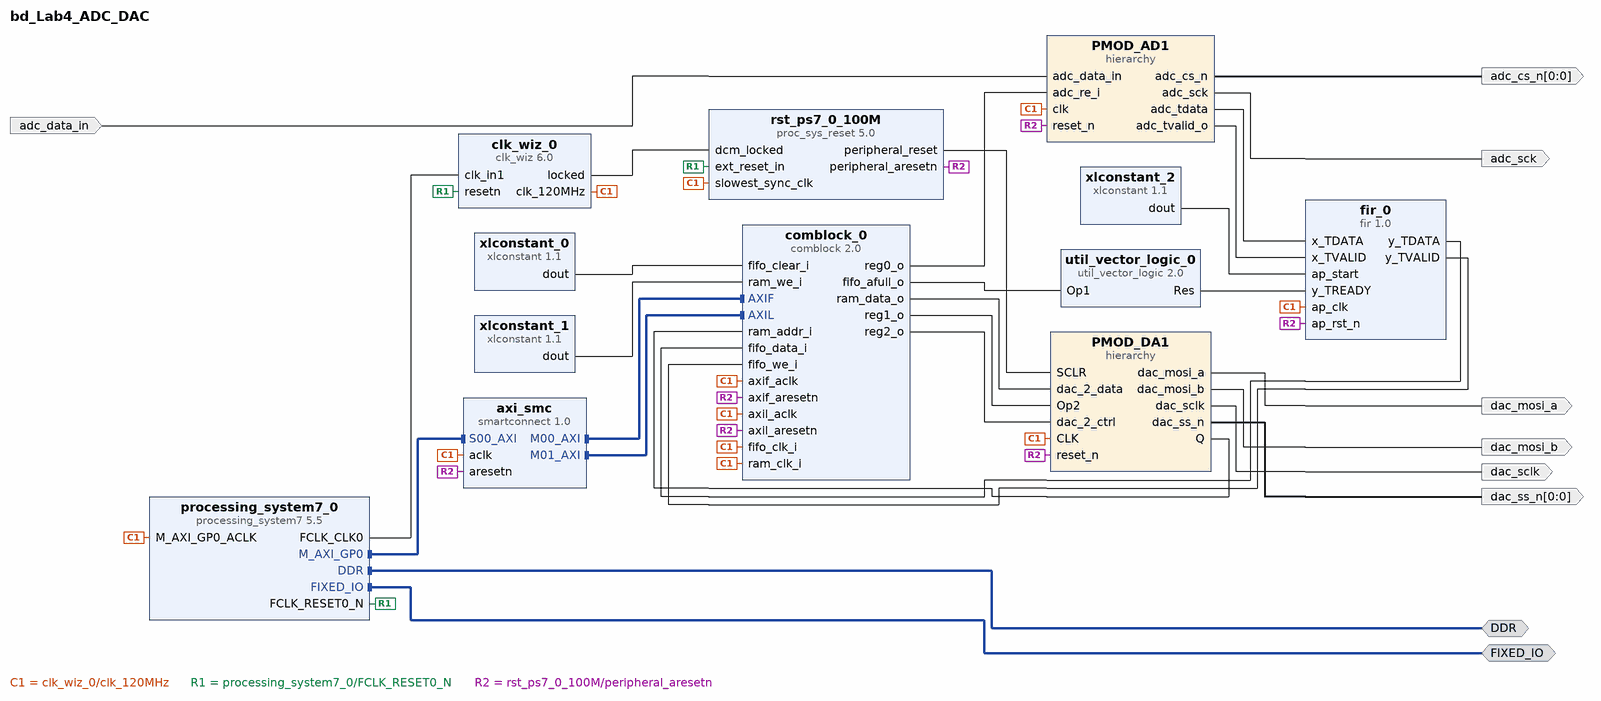
[diagram p0: block diagram of the top level]
# Vivado block design bd_Lab4_ADC_DAC, xc7z020clg484-1, Vivado 2022.2
create_bd_design bd_Lab4_ADC_DAC

create_bd_intf_port -mode Master -vlnv xilinx.com:interface:ddrx_rtl:1.0 DDR
create_bd_intf_port -mode Master -vlnv xilinx.com:display_processing_system7:fixedio_rtl:1.0 FIXED_IO
create_bd_port -dir O -from 0 -to 0 adc_cs_n
create_bd_port -dir I adc_data_in
create_bd_port -dir O adc_sck
create_bd_port -dir O dac_mosi_a
create_bd_port -dir O dac_mosi_b
create_bd_port -dir O dac_sclk
create_bd_port -dir O -from 0 -to 0 dac_ss_n

create_bd_cell -type hier PMOD_AD1
create_bd_cell -type hier PMOD_DA1
create_bd_cell -type ip -vlnv xilinx.com:ip:smartconnect:1.0 axi_smc
set_property -dict {CONFIG.NUM_MI 2 CONFIG.NUM_SI 1} [get_bd_cells axi_smc]
create_bd_cell -type ip -vlnv xilinx.com:ip:clk_wiz:6.0 clk_wiz_0
set_property -dict [list \
  CONFIG.CLKOUT1_DRIVES BUFG \
  CONFIG.CLKOUT1_JITTER 234.636 \
  CONFIG.CLKOUT1_PHASE_ERROR 298.923 \
  CONFIG.CLKOUT1_REQUESTED_OUT_FREQ 120.000 \
  CONFIG.CLKOUT2_DRIVES BUFG \
  CONFIG.CLKOUT3_DRIVES BUFG \
  CONFIG.CLKOUT4_DRIVES BUFG \
  CONFIG.CLKOUT5_DRIVES BUFG \
  CONFIG.CLKOUT6_DRIVES BUFG \
  CONFIG.CLKOUT7_DRIVES BUFG \
  CONFIG.CLK_OUT1_PORT clk_120MHz \
  CONFIG.FEEDBACK_SOURCE FDBK_AUTO \
  CONFIG.MMCM_BANDWIDTH OPTIMIZED \
  CONFIG.MMCM_CLKFBOUT_MULT_F 50.250 \
  CONFIG.MMCM_CLKOUT0_DIVIDE_F 8.375 \
  CONFIG.MMCM_COMPENSATION ZHOLD \
  CONFIG.MMCM_DIVCLK_DIVIDE 5 \
  CONFIG.PRIMITIVE MMCM \
  CONFIG.RESET_PORT resetn \
  CONFIG.RESET_TYPE ACTIVE_LOW \
  CONFIG.USE_LOCKED true \
  CONFIG.USE_RESET true \
] [get_bd_cells clk_wiz_0]
create_bd_cell -type ip -vlnv www.ictp.it:user:comblock:2.0 comblock_0
set_property -dict [list \
  CONFIG.DRAM_IO_AWIDTH 12 \
  CONFIG.DRAM_IO_DEPTH 4096 \
  CONFIG.DRAM_IO_DWIDTH 8 \
  CONFIG.FIFO_IN_DEPTH 4096 \
  CONFIG.REGS_IN_ENA false \
  CONFIG.REGS_OUT_DEPTH 3 \
] [get_bd_cells comblock_0]
create_bd_cell -type ip -vlnv xilinx.com:ip:processing_system7:5.5 processing_system7_0
set_property -dict [list \
  CONFIG.PCW_APU_PERIPHERAL_FREQMHZ 666.666667 \
  CONFIG.PCW_ENET0_ENET0_IO {MIO 16 .. 27} \
  CONFIG.PCW_ENET0_GRP_MDIO_ENABLE 1 \
  CONFIG.PCW_ENET0_GRP_MDIO_IO {MIO 52 .. 53} \
  CONFIG.PCW_ENET0_PERIPHERAL_ENABLE 1 \
  CONFIG.PCW_ENET0_RESET_ENABLE 0 \
  CONFIG.PCW_ENET_RESET_ENABLE 1 \
  CONFIG.PCW_ENET_RESET_SELECT {Share reset pin} \
  CONFIG.PCW_FPGA0_PERIPHERAL_FREQMHZ 100.000000 \
  CONFIG.PCW_FPGA1_PERIPHERAL_FREQMHZ 150.000000 \
  CONFIG.PCW_FPGA2_PERIPHERAL_FREQMHZ 50.000000 \
  CONFIG.PCW_GPIO_MIO_GPIO_ENABLE 1 \
  CONFIG.PCW_GPIO_MIO_GPIO_IO MIO \
  CONFIG.PCW_I2C_RESET_ENABLE 1 \
  CONFIG.PCW_PRESET_BANK1_VOLTAGE {LVCMOS 1.8V} \
  CONFIG.PCW_QSPI_GRP_SINGLE_SS_ENABLE 1 \
  CONFIG.PCW_QSPI_GRP_SINGLE_SS_IO {MIO 1 .. 6} \
  CONFIG.PCW_QSPI_PERIPHERAL_ENABLE 1 \
  CONFIG.PCW_QSPI_PERIPHERAL_FREQMHZ 200.000000 \
  CONFIG.PCW_QSPI_QSPI_IO {MIO 1 .. 6} \
  CONFIG.PCW_SD0_GRP_CD_ENABLE 1 \
  CONFIG.PCW_SD0_GRP_CD_IO {MIO 47} \
  CONFIG.PCW_SD0_GRP_WP_ENABLE 1 \
  CONFIG.PCW_SD0_GRP_WP_IO {MIO 46} \
  CONFIG.PCW_SD0_PERIPHERAL_ENABLE 1 \
  CONFIG.PCW_SD0_SD0_IO {MIO 40 .. 45} \
  CONFIG.PCW_SDIO_PERIPHERAL_FREQMHZ 50 \
  CONFIG.PCW_SINGLE_QSPI_DATA_MODE x4 \
  CONFIG.PCW_UART1_PERIPHERAL_ENABLE 1 \
  CONFIG.PCW_UART1_UART1_IO {MIO 48 .. 49} \
  CONFIG.PCW_UART_PERIPHERAL_FREQMHZ 50 \
  CONFIG.PCW_UIPARAM_DDR_FREQ_MHZ 533.333313 \
  CONFIG.PCW_UIPARAM_DDR_PARTNO {MT41J128M16 HA-15E} \
  CONFIG.PCW_USB0_PERIPHERAL_ENABLE 0 \
  CONFIG.PCW_USB_RESET_ENABLE 1 \
  CONFIG.preset ZedBoard \
] [get_bd_cells processing_system7_0]
# 221 more settings of processing_system7_0 are not shown: defaults, MIO pin electricals, DDR timing, and values the tool derives
create_bd_cell -type ip -vlnv xilinx.com:ip:proc_sys_reset:5.0 rst_ps7_0_100M
create_bd_cell -type ip -vlnv xilinx.com:ip:util_vector_logic:2.0 util_vector_logic_0
set_property -dict {CONFIG.C_OPERATION not CONFIG.C_SIZE 1} [get_bd_cells util_vector_logic_0]
create_bd_cell -type ip -vlnv xilinx.com:ip:xlconstant:1.1 xlconstant_0
set_property -dict {CONFIG.CONST_VAL 0} [get_bd_cells xlconstant_0]
create_bd_cell -type ip -vlnv xilinx.com:ip:xlconstant:1.1 xlconstant_1
set_property -dict {CONFIG.CONST_VAL 0} [get_bd_cells xlconstant_1]
create_bd_cell -type ip -vlnv xilinx.com:ip:xlconstant:1.1 xlconstant_2
create_bd_cell -type ip -vlnv xilinx.com:hls:fir:1.0 fir_0

# ---- hierarchy /PMOD_AD1 ----
current_bd_instance /PMOD_AD1
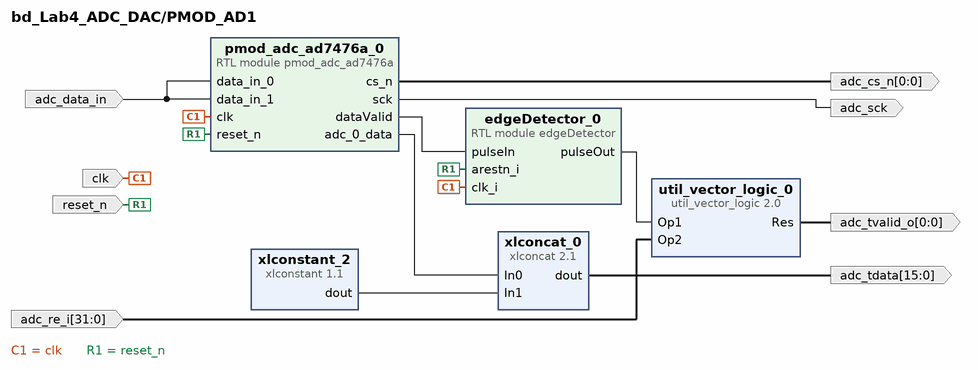
[diagram p1: block diagram inside /PMOD_AD1]
create_bd_pin -dir O -from 0 -to 0 adc_cs_n
create_bd_pin -dir I adc_data_in
create_bd_pin -dir I -from 31 -to 0 adc_re_i
create_bd_pin -dir O adc_sck
create_bd_pin -dir O -from 15 -to 0 adc_tdata
create_bd_pin -dir O -from 0 -to 0 adc_tvalid_o
create_bd_pin -dir I -type clk clk
create_bd_pin -dir I -type rst reset_n

create_bd_cell -type module -reference edgeDetector edgeDetector_0
create_bd_cell -type module -reference pmod_adc_ad7476a pmod_adc_ad7476a_0
set_property -dict {CONFIG.clk_freq 120 CONFIG.spi_clk_div 2} [get_bd_cells pmod_adc_ad7476a_0]
create_bd_cell -type ip -vlnv xilinx.com:ip:util_vector_logic:2.0 util_vector_logic_0
set_property -dict {CONFIG.C_SIZE 1} [get_bd_cells util_vector_logic_0]
create_bd_cell -type ip -vlnv xilinx.com:ip:xlconcat:2.1 xlconcat_0
set_property -dict {CONFIG.IN0_WIDTH 12 CONFIG.IN1_WIDTH 4} [get_bd_cells xlconcat_0]
create_bd_cell -type ip -vlnv xilinx.com:ip:xlconstant:1.1 xlconstant_2
set_property -dict {CONFIG.CONST_VAL 0 CONFIG.CONST_WIDTH 4} [get_bd_cells xlconstant_2]

# ---- hierarchy /PMOD_DA1 ----
current_bd_instance /PMOD_DA1
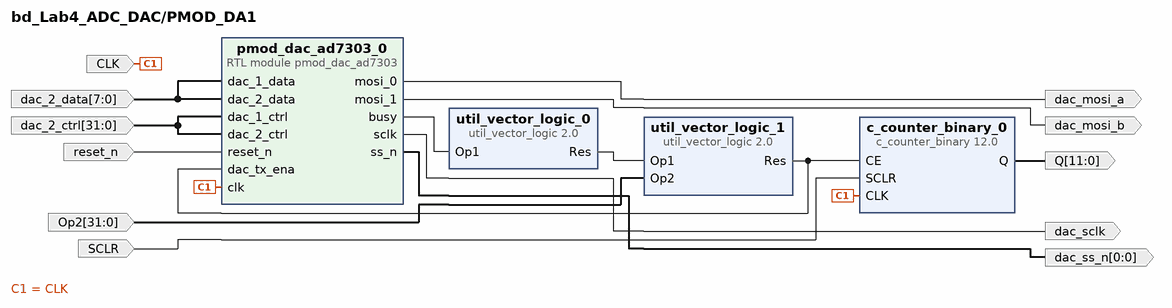
[diagram p2: block diagram inside /PMOD_DA1]
create_bd_pin -dir I -type clk CLK
create_bd_pin -dir I -from 31 -to 0 Op2
create_bd_pin -dir O -from 11 -to 0 -type data Q
create_bd_pin -dir I -type rst SCLR
create_bd_pin -dir I -from 31 -to 0 dac_2_ctrl
create_bd_pin -dir I -from 7 -to 0 dac_2_data
create_bd_pin -dir O dac_mosi_a
create_bd_pin -dir O dac_mosi_b
create_bd_pin -dir O dac_sclk
create_bd_pin -dir O -from 0 -to 0 dac_ss_n
create_bd_pin -dir I -type rst reset_n

create_bd_cell -type ip -vlnv xilinx.com:ip:c_counter_binary:12.0 c_counter_binary_0
set_property -dict {CONFIG.CE true CONFIG.Output_Width 12 CONFIG.SCLR true} [get_bd_cells c_counter_binary_0]
create_bd_cell -type module -reference pmod_dac_ad7303 pmod_dac_ad7303_0
set_property -dict {CONFIG.clk_freq 120 CONFIG.spi_clk_div 5} [get_bd_cells pmod_dac_ad7303_0]
create_bd_cell -type ip -vlnv xilinx.com:ip:util_vector_logic:2.0 util_vector_logic_0
set_property -dict {CONFIG.C_OPERATION not CONFIG.C_SIZE 1} [get_bd_cells util_vector_logic_0]
create_bd_cell -type ip -vlnv xilinx.com:ip:util_vector_logic:2.0 util_vector_logic_1
set_property -dict {CONFIG.C_SIZE 1} [get_bd_cells util_vector_logic_1]

# ---- connections ----

current_bd_instance /PMOD_AD1
connect_bd_net -net comblock_0_reg0_o [get_bd_pins adc_re_i] [get_bd_pins util_vector_logic_0/Op2]
connect_bd_net -net data_in_0_0_1 [get_bd_pins adc_data_in] [get_bd_pins pmod_adc_ad7476a_0/data_in_0] [get_bd_pins pmod_adc_ad7476a_0/data_in_1]
connect_bd_net [get_bd_pins edgeDetector_0/pulseOut] [get_bd_pins util_vector_logic_0/Op1]
connect_bd_net [get_bd_pins pmod_adc_ad7476a_0/adc_0_data] [get_bd_pins xlconcat_0/In0]
connect_bd_net [get_bd_pins pmod_adc_ad7476a_0/cs_n] [get_bd_pins adc_cs_n]
connect_bd_net [get_bd_pins pmod_adc_ad7476a_0/dataValid] [get_bd_pins edgeDetector_0/pulseIn]
connect_bd_net [get_bd_pins pmod_adc_ad7476a_0/sck] [get_bd_pins adc_sck]
connect_bd_net -net processing_system7_0_FCLK_CLK0 [get_bd_pins clk] [get_bd_pins edgeDetector_0/clk_i] [get_bd_pins pmod_adc_ad7476a_0/clk]
connect_bd_net -net rst_ps7_0_100M_peripheral_aresetn [get_bd_pins reset_n] \
  [get_bd_pins edgeDetector_0/arestn_i] [get_bd_pins pmod_adc_ad7476a_0/reset_n]
connect_bd_net [get_bd_pins util_vector_logic_0/Res] [get_bd_pins adc_tvalid_o]
connect_bd_net [get_bd_pins xlconcat_0/dout] [get_bd_pins adc_tdata]
connect_bd_net [get_bd_pins xlconstant_2/dout] [get_bd_pins xlconcat_0/In1]

current_bd_instance /PMOD_DA1
connect_bd_net [get_bd_pins c_counter_binary_0/Q] [get_bd_pins Q]
connect_bd_net -net comblock_0_ram_data_o [get_bd_pins dac_2_data] \
  [get_bd_pins pmod_dac_ad7303_0/dac_1_data] [get_bd_pins pmod_dac_ad7303_0/dac_2_data]
connect_bd_net -net comblock_0_reg1_o [get_bd_pins Op2] [get_bd_pins util_vector_logic_1/Op2]
connect_bd_net -net comblock_0_reg2_o [get_bd_pins dac_2_ctrl] [get_bd_pins pmod_dac_ad7303_0/dac_1_ctrl] [get_bd_pins pmod_dac_ad7303_0/dac_2_ctrl]
connect_bd_net [get_bd_pins pmod_dac_ad7303_0/busy] [get_bd_pins util_vector_logic_0/Op1]
connect_bd_net [get_bd_pins pmod_dac_ad7303_0/mosi_0] [get_bd_pins dac_mosi_a]
connect_bd_net [get_bd_pins pmod_dac_ad7303_0/mosi_1] [get_bd_pins dac_mosi_b]
connect_bd_net [get_bd_pins pmod_dac_ad7303_0/sclk] [get_bd_pins dac_sclk]
connect_bd_net [get_bd_pins pmod_dac_ad7303_0/ss_n] [get_bd_pins dac_ss_n]
connect_bd_net -net processing_system7_0_FCLK_CLK0 [get_bd_pins CLK] [get_bd_pins c_counter_binary_0/CLK] [get_bd_pins pmod_dac_ad7303_0/clk]
connect_bd_net -net rst_ps7_0_100M_peripheral_aresetn [get_bd_pins reset_n] [get_bd_pins pmod_dac_ad7303_0/reset_n]
connect_bd_net -net rst_ps7_0_100M_peripheral_reset [get_bd_pins SCLR] [get_bd_pins c_counter_binary_0/SCLR]
connect_bd_net [get_bd_pins util_vector_logic_0/Res] [get_bd_pins util_vector_logic_1/Op1]
connect_bd_net [get_bd_pins util_vector_logic_1/Res] [get_bd_pins c_counter_binary_0/CE] [get_bd_pins pmod_dac_ad7303_0/dac_tx_ena]

current_bd_instance /
connect_bd_intf_net [get_bd_intf_pins axi_smc/M00_AXI] [get_bd_intf_pins comblock_0/AXIF]
connect_bd_intf_net [get_bd_intf_pins axi_smc/M01_AXI] [get_bd_intf_pins comblock_0/AXIL]
connect_bd_intf_net [get_bd_intf_ports DDR] [get_bd_intf_pins processing_system7_0/DDR]
connect_bd_intf_net [get_bd_intf_ports FIXED_IO] [get_bd_intf_pins processing_system7_0/FIXED_IO]
connect_bd_intf_net [get_bd_intf_pins axi_smc/S00_AXI] [get_bd_intf_pins processing_system7_0/M_AXI_GP0]
connect_bd_net -net c_counter_binary_0_Q [get_bd_pins PMOD_DA1/Q] [get_bd_pins comblock_0/ram_addr_i]
connect_bd_net [get_bd_pins clk_wiz_0/locked] [get_bd_pins rst_ps7_0_100M/dcm_locked]
connect_bd_net [get_bd_pins comblock_0/fifo_afull_o] [get_bd_pins util_vector_logic_0/Op1]
connect_bd_net [get_bd_pins comblock_0/ram_data_o] [get_bd_pins PMOD_DA1/dac_2_data]
connect_bd_net [get_bd_pins comblock_0/reg0_o] [get_bd_pins PMOD_AD1/adc_re_i]
connect_bd_net [get_bd_pins comblock_0/reg1_o] [get_bd_pins PMOD_DA1/Op2]
connect_bd_net [get_bd_pins comblock_0/reg2_o] [get_bd_pins PMOD_DA1/dac_2_ctrl]
connect_bd_net -net data_in_0_0_1 [get_bd_ports adc_data_in] [get_bd_pins PMOD_AD1/adc_data_in]
connect_bd_net -net fir_1_y_TDATA [get_bd_pins fir_0/y_TDATA] [get_bd_pins comblock_0/fifo_data_i]
connect_bd_net -net fir_1_y_TVALID [get_bd_pins fir_0/y_TVALID] [get_bd_pins comblock_0/fifo_we_i]
connect_bd_net -net pmod_adc_ad7476a_0_cs_n [get_bd_pins PMOD_AD1/adc_cs_n] [get_bd_ports adc_cs_n]
connect_bd_net -net pmod_adc_ad7476a_0_sck [get_bd_pins PMOD_AD1/adc_sck] [get_bd_ports adc_sck]
connect_bd_net -net pmod_dac_ad7303_0_mosi_0 [get_bd_pins PMOD_DA1/dac_mosi_a] [get_bd_ports dac_mosi_a]
connect_bd_net -net pmod_dac_ad7303_0_mosi_1 [get_bd_pins PMOD_DA1/dac_mosi_b] [get_bd_ports dac_mosi_b]
connect_bd_net -net pmod_dac_ad7303_0_sclk [get_bd_pins PMOD_DA1/dac_sclk] [get_bd_ports dac_sclk]
connect_bd_net -net pmod_dac_ad7303_0_ss_n [get_bd_pins PMOD_DA1/dac_ss_n] [get_bd_ports dac_ss_n]
connect_bd_net -net processing_system7_0_FCLK_CLK0 [get_bd_pins clk_wiz_0/clk_120MHz] \
  [get_bd_pins PMOD_AD1/clk] [get_bd_pins PMOD_DA1/CLK] [get_bd_pins axi_smc/aclk] [get_bd_pins comblock_0/axif_aclk] \
  [get_bd_pins comblock_0/axil_aclk] [get_bd_pins comblock_0/fifo_clk_i] [get_bd_pins comblock_0/ram_clk_i] \
  [get_bd_pins processing_system7_0/M_AXI_GP0_ACLK] [get_bd_pins rst_ps7_0_100M/slowest_sync_clk] [get_bd_pins fir_0/ap_clk]
connect_bd_net [get_bd_pins processing_system7_0/FCLK_CLK0] [get_bd_pins clk_wiz_0/clk_in1]
connect_bd_net [get_bd_pins processing_system7_0/FCLK_RESET0_N] [get_bd_pins clk_wiz_0/resetn] [get_bd_pins rst_ps7_0_100M/ext_reset_in]
connect_bd_net [get_bd_pins rst_ps7_0_100M/peripheral_aresetn] \
  [get_bd_pins PMOD_AD1/reset_n] [get_bd_pins PMOD_DA1/reset_n] [get_bd_pins axi_smc/aresetn] \
  [get_bd_pins comblock_0/axif_aresetn] [get_bd_pins comblock_0/axil_aresetn] [get_bd_pins fir_0/ap_rst_n]
connect_bd_net [get_bd_pins rst_ps7_0_100M/peripheral_reset] [get_bd_pins PMOD_DA1/SCLR]
connect_bd_net -net s_axis_tdata_1 [get_bd_pins PMOD_AD1/adc_tdata] [get_bd_pins fir_0/x_TDATA]
connect_bd_net -net util_vector_logic_0_Res [get_bd_pins PMOD_AD1/adc_tvalid_o] [get_bd_pins fir_0/x_TVALID]
connect_bd_net [get_bd_pins util_vector_logic_0/Res] [get_bd_pins fir_0/y_TREADY]
connect_bd_net [get_bd_pins xlconstant_0/dout] [get_bd_pins comblock_0/fifo_clear_i]
connect_bd_net [get_bd_pins xlconstant_1/dout] [get_bd_pins comblock_0/ram_we_i]
connect_bd_net [get_bd_pins xlconstant_2/dout] [get_bd_pins fir_0/ap_start]

# ---- address map ----
assign_bd_address -offset 0x43C00000 -range 256K -target_address_space [get_bd_addr_spaces processing_system7_0/Data] [get_bd_addr_segs comblock_0/AXIF/AXIF]
assign_bd_address -offset 0x43C40000 -range 64K -target_address_space [get_bd_addr_spaces processing_system7_0/Data] [get_bd_addr_segs comblock_0/AXIL/AXIL]

validate_bd_design
save_bd_design
